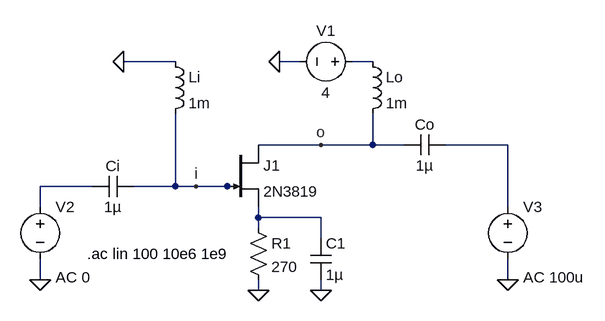
[diagram p0: schematic AC.asc]
AC.asc, the LTspice schematic file:
Version 4
SHEET 1 880 680
WIRE 48 16 -32 16
WIRE 240 16 208 16
WIRE 352 16 320 16
WIRE 272 144 176 144
WIRE 352 144 352 96
WIRE 352 144 272 144
WIRE 400 144 352 144
WIRE 560 144 464 144
WIRE -80 208 -160 208
WIRE 48 208 48 96
WIRE 48 208 -16 208
WIRE 80 208 48 208
WIRE 128 208 80 208
WIRE 144 208 128 208
WIRE -160 240 -160 208
WIRE 560 240 560 144
WIRE 176 256 176 240
WIRE 272 256 176 256
WIRE 176 272 176 256
WIRE 272 288 272 256
WIRE -160 352 -160 320
WIRE 560 352 560 320
WIRE 176 368 176 352
WIRE 272 368 272 352
FLAG 176 368 0
FLAG 272 368 0
FLAG -32 16 0
FLAG 208 16 0
FLAG -160 352 0
FLAG 560 352 0
FLAG 80 208 i
FLAG 272 144 o
SYMBOL njf 128 144 R0
SYMATTR InstName J1
SYMATTR Value 2N3819
SYMBOL res 160 256 R0
SYMATTR InstName R1
SYMATTR Value 270
SYMBOL cap 256 288 R0
SYMATTR InstName C1
SYMATTR Value 1µ
SYMBOL ind 336 0 R0
SYMATTR InstName Lo
SYMATTR Value 1m
SYMBOL ind 32 0 R0
SYMATTR InstName Li
SYMATTR Value 1m
SYMBOL cap 464 128 R90
WINDOW 0 0 32 VBottom 2
WINDOW 3 32 32 VTop 2
SYMATTR InstName Co
SYMATTR Value 1µ
SYMBOL cap -80 224 R270
WINDOW 0 32 32 VTop 2
WINDOW 3 0 32 VBottom 2
SYMATTR InstName Ci
SYMATTR Value 1µ
SYMBOL voltage 336 16 R90
WINDOW 0 -32 56 VBottom 2
WINDOW 3 32 56 VTop 2
SYMATTR InstName V1
SYMATTR Value 4
SYMBOL voltage -160 224 R0
WINDOW 123 24 124 Left 2
WINDOW 39 0 0 Left 2
SYMATTR InstName V2
SYMATTR Value ""
SYMATTR Value2 AC 0
SYMBOL voltage 560 224 R0
WINDOW 123 24 124 Left 2
WINDOW 39 0 0 Left 2
SYMATTR InstName V3
SYMATTR Value ""
SYMATTR Value2 AC 100u
TEXT -88 312 Left 2 !.ac lin 100 10e6 1e9

The netlist it stands for:
* AC.asc
J1 o i N004 2N3819
R1 N004 0 270
C1 N004 0 1µ
Lo N001 o 1m
Li 0 i 1m
Co N002 o 1µ
Ci N003 i 1µ
V1 N001 0 4
V2 N003 0 AC 0
V3 N002 0 AC 100u
.model NJF NJF
.model PJF PJF
.lib standard.jft
.ac lin 100 10e6 1e9
.backanno
.end